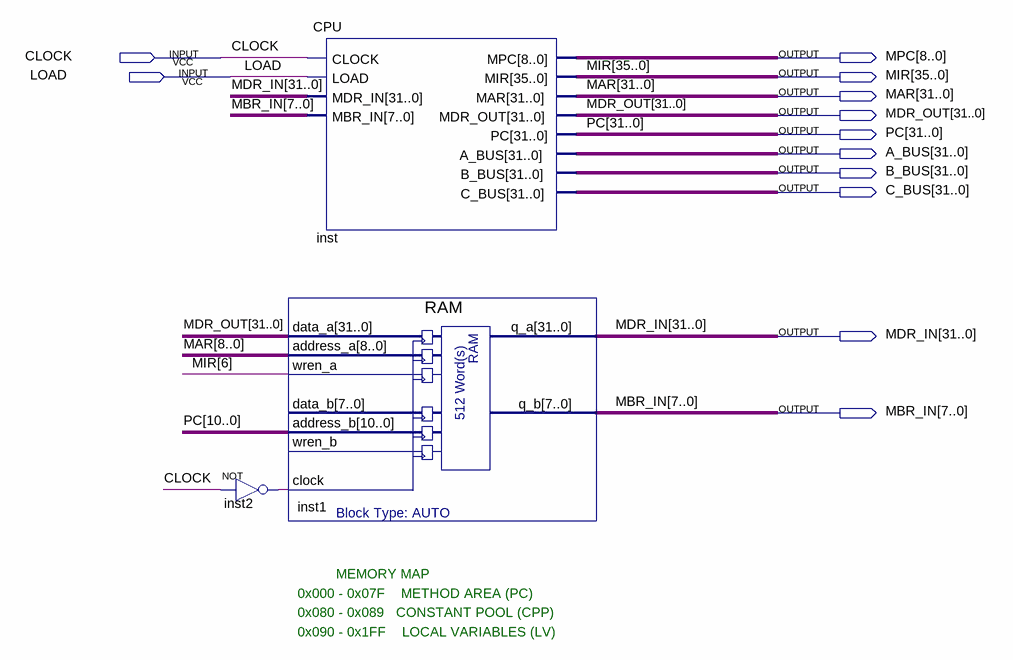
[diagram p0: schematic sheet]
// Quartus schematic MIC1.bdf as structural Verilog: 3 symbols, 12 pins
module MIC1 (
  input  CLOCK,
  input  LOAD,
  output [8:0] MPC,
  output [35:0] MIR,
  output [31:0] MAR,
  output [31:0] MDR_OUT,
  output [31:0] PC,
  output [31:0] A_BUS,
  output [31:0] B_BUS,
  output [31:0] C_BUS,
  output [31:0] MDR_IN,
  output [7:0] MBR_IN
);

  wire inst2_out;

  not inst2 (inst2_out, CLOCK);
  CPU inst (
    .CLOCK(CLOCK), .LOAD(LOAD), .MDR_IN(MDR_IN), .MBR_IN(MBR_IN), .MPC(MPC), .MIR(MIR), .MAR(MAR),
    .MDR_OUT(MDR_OUT), .PC(PC), .A_BUS(A_BUS), .B_BUS(B_BUS), .C_BUS(C_BUS));
  RAM inst1 (
    .data_a(MDR_OUT), .address_a(MAR[8:0]), .wren_a(MIR[6]), .address_b(PC[10:0]), .clock(inst2_out),
    .q_a(MDR_IN), .q_b(MBR_IN));  // open: data_b, wren_b

  // Notes on the sheet:
  //   MEMORY MAP
  //   0x000 - 0x07F    METHOD AREA (PC)
  //   0x080 - 0x089   CONSTANT POOL (CPP)
  //   0x090 - 0x1FF    LOCAL VARIABLES (LV)
endmodule
